# Altium schematic sheet led.SchDoc
size A4; SheetNumber: 5; SheetTotal: 7
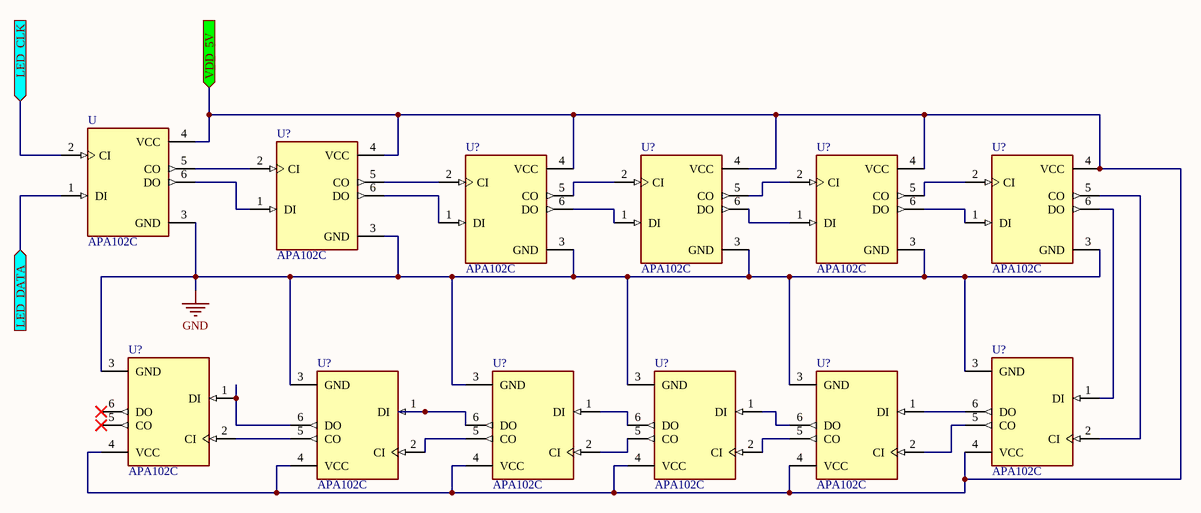
[diagram p0: led.SchDoc]

## Parts
(Parts that share a designator on the sheet are numbered #1, #2 ... from top to bottom, then left to right.)
U  APA102C  [SON160P500X500X140-6N]
U?#1  APA102C  [SON160P500X500X140-6N]
U?#2  APA102C  [SON160P500X500X140-6N]
U?#3  APA102C  [SON160P500X500X140-6N]
U?#4  APA102C  [SON160P500X500X140-6N]
U?#5  APA102C  [SON160P500X500X140-6N]
U?#6  APA102C  [SON160P500X500X140-6N]
U?#7  APA102C  [SON160P500X500X140-6N]
U?#8  APA102C  [SON160P500X500X140-6N]
U?#9  APA102C  [SON160P500X500X140-6N]
U?#10  APA102C  [SON160P500X500X140-6N]
U?#11  APA102C  [SON160P500X500X140-6N]

## Ports
LED_CLK (in), LED_DATA (in), VDD_5V (in)

## Nets
GND: U.3(GND) U?#1.3(GND) U?#2.3(GND) U?#3.3(GND) U?#4.3(GND) U?#5.3(GND) U?#6.3(GND) U?#7.3(GND) U?#8.3(GND) U?#9.3(GND) U?#10.3(GND) U?#11.3(GND)
LED_CLK: U.2(CI) ; port LED_CLK
LED_DATA: U.1(DI) ; port LED_DATA
VDD_5V: U.4(VCC) U?#1.4(VCC) U?#2.4(VCC) U?#3.4(VCC) U?#4.4(VCC) U?#5.4(VCC) U?#6.4(VCC) U?#7.4(VCC) U?#8.4(VCC) U?#9.4(VCC) U?#10.4(VCC) U?#11.4(VCC) ; port VDD_5V
NetU?#1_5: U?#1.5(CO) U?#2.2(CI)
NetU?#1_6: U?#1.6(DO) U?#2.1(DI)
NetU?#2_5: U?#2.5(CO) U?#3.2(CI)
NetU?#2_6: U?#2.6(DO) U?#3.1(DI)
NetU?#3_5: U?#3.5(CO) U?#4.2(CI)
NetU?#3_6: U?#3.6(DO) U?#4.1(DI)
NetU?#4_5: U?#4.5(CO) U?#5.2(CI)
NetU?#4_6: U?#4.6(DO) U?#5.1(DI)
NetU?#5_5: U?#5.5(CO) U?#7.2(CI)
NetU?#5_6: U?#5.6(DO) U?#7.1(DI)
NetU?#6_1: U?#6.1(DI) U?#8.6(DO)
NetU?#6_2: U?#6.2(CI) U?#8.5(CO)
NetU?#7_5: U?#7.5(CO) U?#11.2(CI)
NetU?#7_6: U?#7.6(DO) U?#11.1(DI)
NetU?#8_1: U?#8.1(DI) U?#9.6(DO)
NetU?#8_2: U?#8.2(CI) U?#9.5(CO)
NetU?#9_1: U?#9.1(DI) U?#10.6(DO)
NetU?#9_2: U?#9.2(CI) U?#10.5(CO)
NetU?#10_1: U?#10.1(DI) U?#11.6(DO)
NetU?#10_2: U?#10.2(CI) U?#11.5(CO)
NetU_5: U.5(CO) U?#1.2(CI)
NetU_6: U.6(DO) U?#1.1(DI)

Not connected (* = marked no-connect by the designer): U?#6 5(CO)* 6(DO)*

## Library data of the parts
U U?#1-U?#11 = APA102C: Addressable Lighting - 1 LED Discrete Serial Red, Green, Blue _RGB_ 5.00mm L x 5.00mm W; MF: Shiji Lighting; Package: SMD-6 Shiji Lightning; Value: *; Availability: Unavailable; SnapEDA_Link: https://www.snapeda.com/parts/APA102C/Shiji%20Lighting/view-part/231897/?ref=snap; Price: None; MP: APA102C